# EAGLE design avr-clock (EAGLE 6.1)
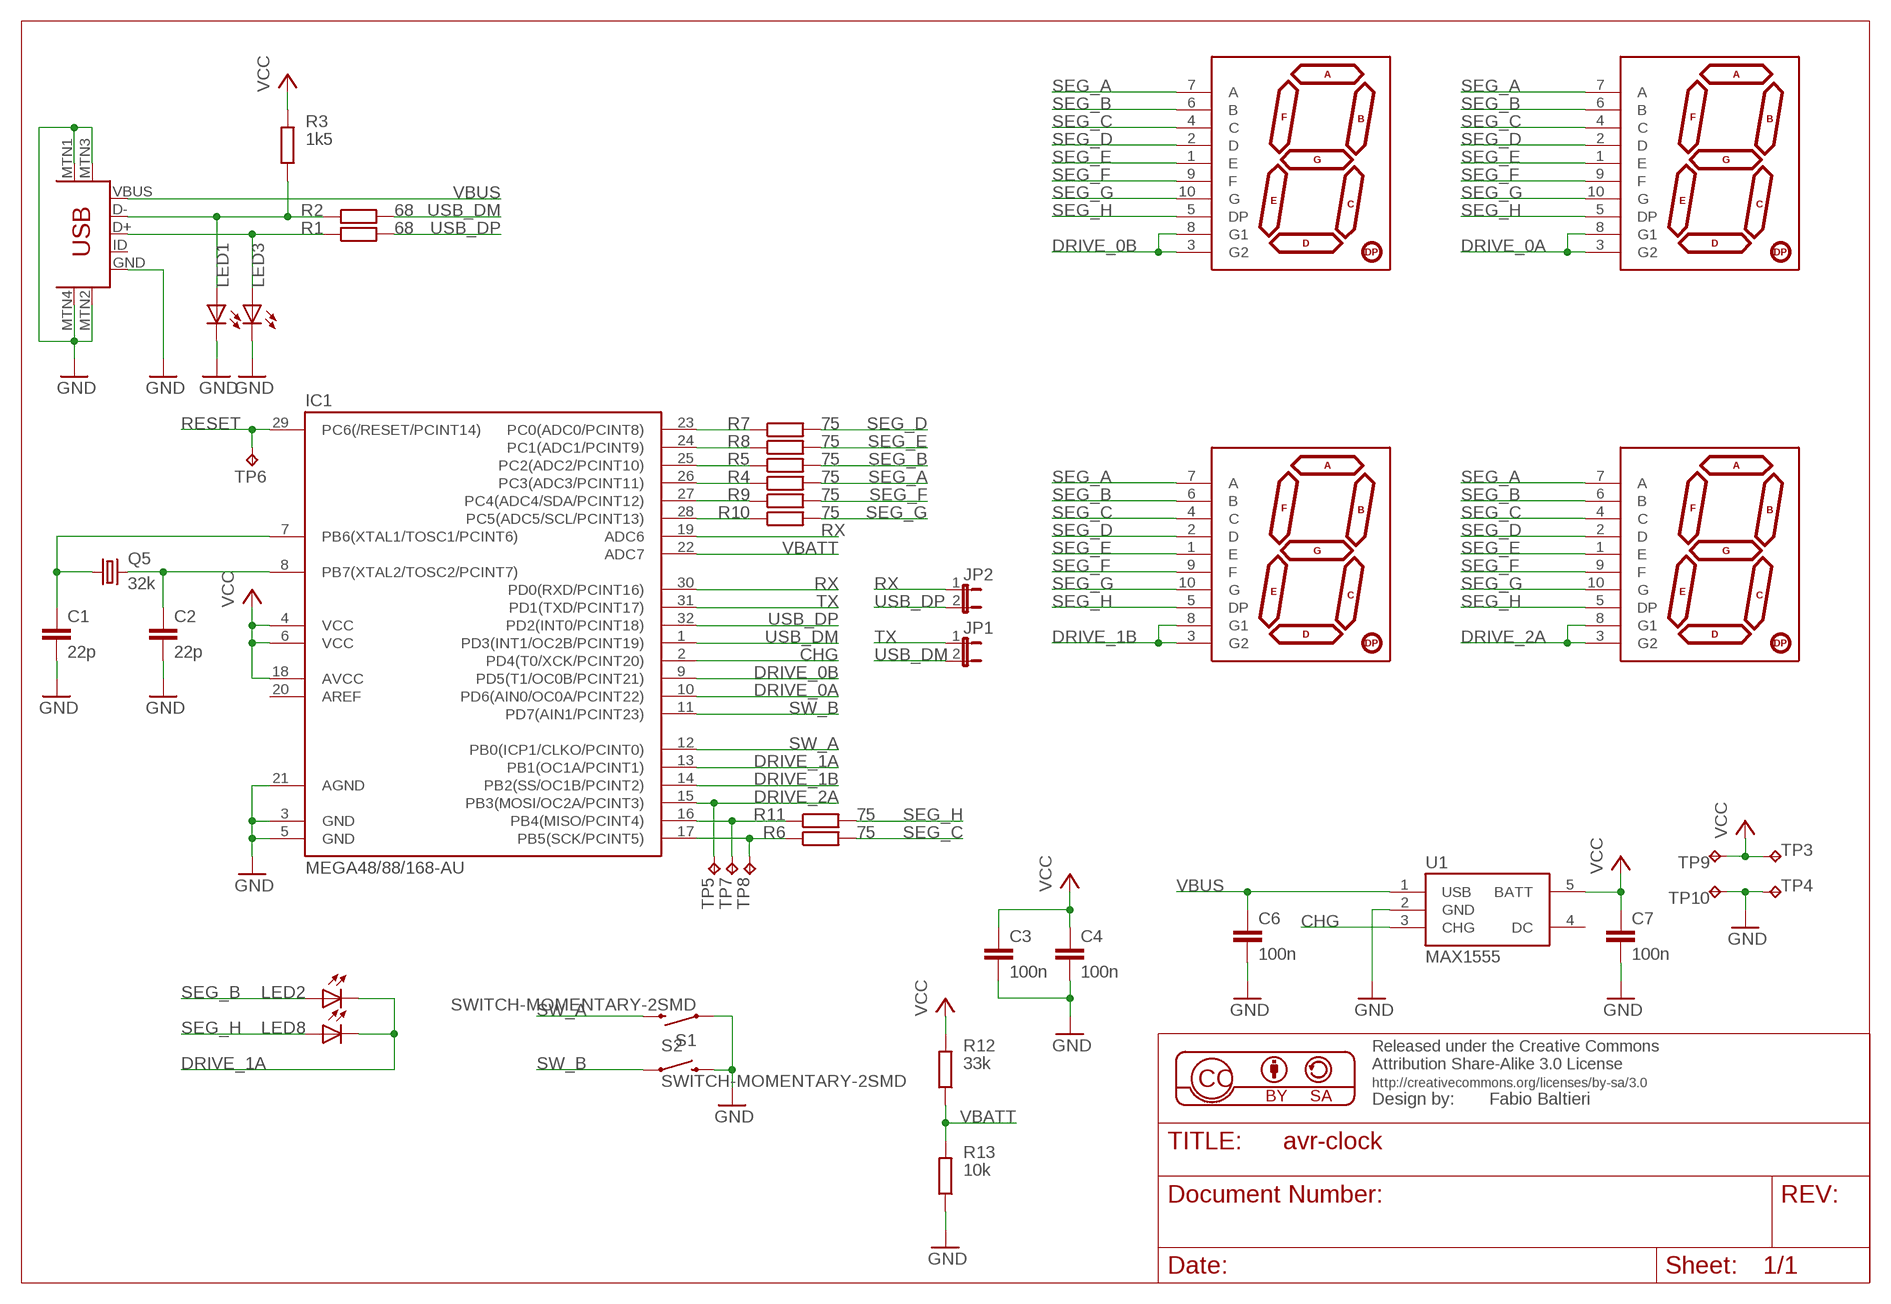
[diagram p0: schematic, sheet 1]

## Parts
C1  22p  C-EUC0805  [C0805]
C2  22p  C-EUC0805  [C0805]
C3  100n  C-EUC0805  [C0805]
C4  100n  C-EUC0805  [C0805]
C6  100n  C-EUC0805  [C0805]
C7  100n  C-EUC0805  [C0805]
IC1  MEGA48/88/168-AU  [TQFP32-08]
JP1  JUMPER-2SMD-NC  [SJ_2S]
JP2  JUMPER-2SMD-NC  [SJ_2S]
LED1  LEDCHIPLED_1206  [CHIPLED_1206]
LED2  LEDCHIPLED_1206  [CHIPLED_1206]
LED3  LEDCHIPLED_1206  [CHIPLED_1206]
LED8  LEDCHIPLED_1206  [CHIPLED_1206]
Q5  32k  CRYSTALCTS406  [CTS406]
R1  68  R-EU_R0603  [R0603]
R2  68  R-EU_R0603  [R0603]
R3  1k5  R-EU_R0603  [R0603]
R4  75  R-EU_R0603  [R0603]
R5  75  R-EU_R0603  [R0603]
R6  75  R-EU_R0603  [R0603]
R7  75  R-EU_R0603  [R0603]
R8  75  R-EU_R0603  [R0603]
R9  75  R-EU_R0603  [R0603]
R10  75  R-EU_R0603  [R0603]
R11  75  R-EU_R0603  [R0603]
R12  33k  R-EU_R0603  [R0603]
R13  10k  R-EU_R0603  [R0603]
S1  SWITCH-MOMENTARY-2SMD  [TACTILE_SWITCH_SMD]
S2  SWITCH-MOMENTARY-2SMD  [TACTILE_SWITCH_SMD]
TP3  TPB1,27  [B1,27]
TP4  TPB1,27  [B1,27]
TP5  TPTP08R  [TP08R]
TP6  TPTP08R  [TP08R]
TP7  TPTP08R  [TP08R]
TP8  TPTP08R  [TP08R]
TP9  TPTP08R  [TP08R]
TP10  TPTP08R  [TP08R]
U1  MAX1555  [SOT23-5]
U$1  7-SEGMENT-DISPLAY-1"-RED  [7-SEGMENT-SMD]
U$2  USB-MINIB-5PIN  [USB-MINIB]
U$3  7-SEGMENT-DISPLAY-1"-RED  [7-SEGMENT-SMD]
U$4  7-SEGMENT-DISPLAY-1"-RED  [7-SEGMENT-SMD]
U$5  7-SEGMENT-DISPLAY-1"-RED  [7-SEGMENT-SMD]

## Nets
CHG: IC1.2(PD4(T0/XCK/PCINT20)) U1.3(CHG)
DRIVE_0A: IC1.10(PD6(AIN0/OC0A/PCINT22)) U$3.3(G2) U$3.8(G1)
DRIVE_0B: IC1.9(PD5(T1/OC0B/PCINT21)) U$1.3(G2) U$1.8(G1)
DRIVE_1A: IC1.13(PB1(OC1A/PCINT1)) LED2.C LED8.C
DRIVE_1B: IC1.14(PB2(SS/OC1B/PCINT2)) U$4.3(G2) U$4.8(G1)
DRIVE_2A: IC1.15(PB3(MOSI/OC2A/PCINT3)) TP5.TP U$5.3(G2) U$5.8(G1)
GND: C1.2 C2.2 C3.2 C4.2 C6.2 C7.2 IC1.3(GND) IC1.5(GND) IC1.21(AGND) LED1.C LED3.C R13.1 S1.1 S2.3 TP4.TP TP10.TP U1.2(GND) U$2.GND U$2.MTN1(MTN2) U$2.MTN2(MTN3) U$2.MTN3(MTN1) U$2.MTN4
N$1: C2.1 IC1.8(PB7(XTAL2/TOSC2/PCINT7)) Q5.3
N$2: C1.1 IC1.7(PB6(XTAL1/TOSC1/PCINT6)) Q5.1
N$3: IC1.16(PB4(MISO/PCINT4)) R11.1 TP7.TP
N$4: IC1.17(PB5(SCK/PCINT5)) R6.1 TP8.TP
N$5: IC1.24(PC1(ADC1/PCINT9)) R8.1
N$6: IC1.25(PC2(ADC2/PCINT10)) R5.1
N$7: IC1.26(PC3(ADC3/PCINT11)) R4.1
N$8: IC1.27(PC4(ADC4/SDA/PCINT12)) R9.1
N$9: IC1.23(PC0(ADC0/PCINT8)) R7.1
N$12: IC1.28(PC5(ADC5/SCL/PCINT13)) R10.1
N$18: LED1.A R2.1 R3.1 U$2.D-
N$19: LED3.A R1.1 U$2.D+
RESET: IC1.29(PC6(/RESET/PCINT14)) TP6.TP
RX: IC1.19(ADC6) IC1.30(PD0(RXD/PCINT16)) JP2.1
SEG_A: R4.2 U$1.7(A) U$3.7(A) U$4.7(A) U$5.7(A)
SEG_B: LED2.A R5.2 U$1.6(B) U$3.6(B) U$4.6(B) U$5.6(B)
SEG_C: R6.2 U$1.4(C) U$3.4(C) U$4.4(C) U$5.4(C)
SEG_D: R7.2 U$1.2(D) U$3.2(D) U$4.2(D) U$5.2(D)
SEG_E: R8.2 U$1.1(E) U$3.1(E) U$4.1(E) U$5.1(E)
SEG_F: R9.2 U$1.9(F) U$3.9(F) U$4.9(F) U$5.9(F)
SEG_G: R10.2 U$1.10(G) U$3.10(G) U$4.10(G) U$5.10(G)
SEG_H: LED8.A R11.2 U$1.5(DP) U$3.5(DP) U$4.5(DP) U$5.5(DP)
SW_A: IC1.12(PB0(ICP1/CLKO/PCINT0)) S1.3
SW_B: IC1.11(PD7(AIN1/PCINT23)) S2.1
TX: IC1.31(PD1(TXD/PCINT17)) JP1.1
USB_DM: IC1.1(PD3(INT1/OC2B/PCINT19)) JP1.2 R2.2
USB_DP: IC1.32(PD2(INT0/PCINT18)) JP2.2 R1.2
VBATT: IC1.22(ADC7) R12.1 R13.2
VBUS: C6.1 U1.1(USB) U$2.VBUS
VCC: C3.1 C4.1 C7.1 IC1.4(VCC) IC1.6(VCC) IC1.18(AVCC) R3.2 R12.2 TP3.TP TP9.TP U1.5(BATT)
Unconnected: IC1.20(AREF) U1.4(DC) U$2.ID

## Library data of the parts
C1-C4 C6 C7 = rcl:C-EU: CAPACITOR, European symbol
IC1 = avr-5:MEGA48/88/168
JP1 JP2 = sparkfun:JUMPER-2: Jumper Basic 0.1" spaced jumper. Use with breakaway headers.
LED1-LED3 LED8 = led:LED: LED OSRAM: - CHIPLED LG R971, LG N971, LY N971, LG Q971, LY Q971, LO R971, LY R971 LH N974, LH R974 LS Q976, LO Q976, LY Q976 LO Q996 - Hyper CHIPLED LW Q18S LB Q993, LB Q99A, LB R99A - SideLED LS A670, LO A670, LY A670, LG A670, LP A670 LB A673, LV A673, LT A673, LW A673 LH A674 LY A675 LS A676, LA A676, LO A676, LY A676, LW A676 LS A679, LY A679, LG A679 - Hyper Micro SIDELED® LS Y876, LA Y876, LO Y876, LY Y876 LT Y87S - SmartLED LW L88C, LW L88S LB L89C, LB L89S, LG L890 LS L89K, LO L89K, LY L89K LS L896, LA L896, LO L896, LY L896 - TOPLED LS T670, LO T670, LY T670, LG T670, LP T670 LSG T670, LSP T670, LSY T670, LOP T670, LYG T670 LG T671, LOG T671, LSG T671 LB T673, LV T673, LT T673, LW T673 LH T674 LS T676, LA T676, LO T676, LY T676, LB T676, LH T676, LSB T676, LW T676 LB T67C, LV T67C, LT T67C, LS T67K, LO T67K, LY T67K, LW E67C LS E67B, LA E67B, LO E67B, LY E67B, LB E67C, LV E67C, LT E67C LW T67C LS T679, LY T679, LG T679 LS T770, LO T770, LY T770, LG T770, LP T770 LB T773, LV T773, LT T773, LW T773 LH T774 LS E675, LA E675, LY E675, LS T675 LS T776, LA T776, LO T776, LY T776, LB T776 LHGB T686 LT T68C, LB T68C - Hyper Mini TOPLED® LB M676 - Mini TOPLED Santana® LG M470 LS M47K, LO M47K, LY M47K Source: http://www.osram.convergy.de LUXEON: - LUMILED® LXK2-PW12-R00, LXK2-PW12-S00, LXK2-PW14-U00, LXK2-PW14-V00 LXK2-PM12-R00, LXK2-PM12-S00, LXK2-PM14-U00 LXK2-PE12-Q00, LXK2-PE12-R00, LXK2-PE12-S00, LXK2-PE14-T00, LXK2-PE14-U00 LXK2-PB12-K00, LXK2-PB12-L00, LXK2-PB12-M00, LXK2-PB14-N00, LXK2-PB14-P00, LXK2-PB14-Q00 LXK2-PR12-L00, LXK2-PR12-M00, LXK2-PR14-Q00, LXK2-PR14-R00 LXK2-PD12-Q00, LXK2-PD12-R00, LXK2-PD12-S00 LXK2-PH12-R00, LXK2-PH12-S00 LXK2-PL12-P00, LXK2-PL12-Q00, LXK2-PL12-R00 Source: www.luxeon.com KINGBRIGHT: KA-3528ASYC Source: www.kingbright.com
Q5 = crystal:CRYSTAL: CRYSTAL
R1-R13 = rcl:R-EU_: RESISTOR, European symbol
S1 S2 = sparkfun:SWITCH-MOMENTARY-2
TP3-TP10 = testpad:TP: Test pad
U1 = sparkfun:MAX1555: MAX1555 Lithium Charger IC SOT-23 Lithium Polymer charging IC. Schematic element and footprint proven. Spark Fun Electronics SKU : COM-00674
U$1 U$3-U$5 = balto:7-SEGMENT-DISPLAY-1"-RED: 7-Segment Display 1" Red (COM-08546)
U$2 = sparkfun:USB-MINIB: Mini-USB "B" connector with 5th pin broken out. Created new symbol breaking out 5th "ID" pin in mini/micro USB connector spec. See: http://en.wikipedia.org/wiki/Mini_usb#Cables. Uses same footprint as 4-pin symbol. Also added pins to connect to mounting / shield pads if required (probably not generally needed as signals aren't shielded once they leave the connector).

## Board
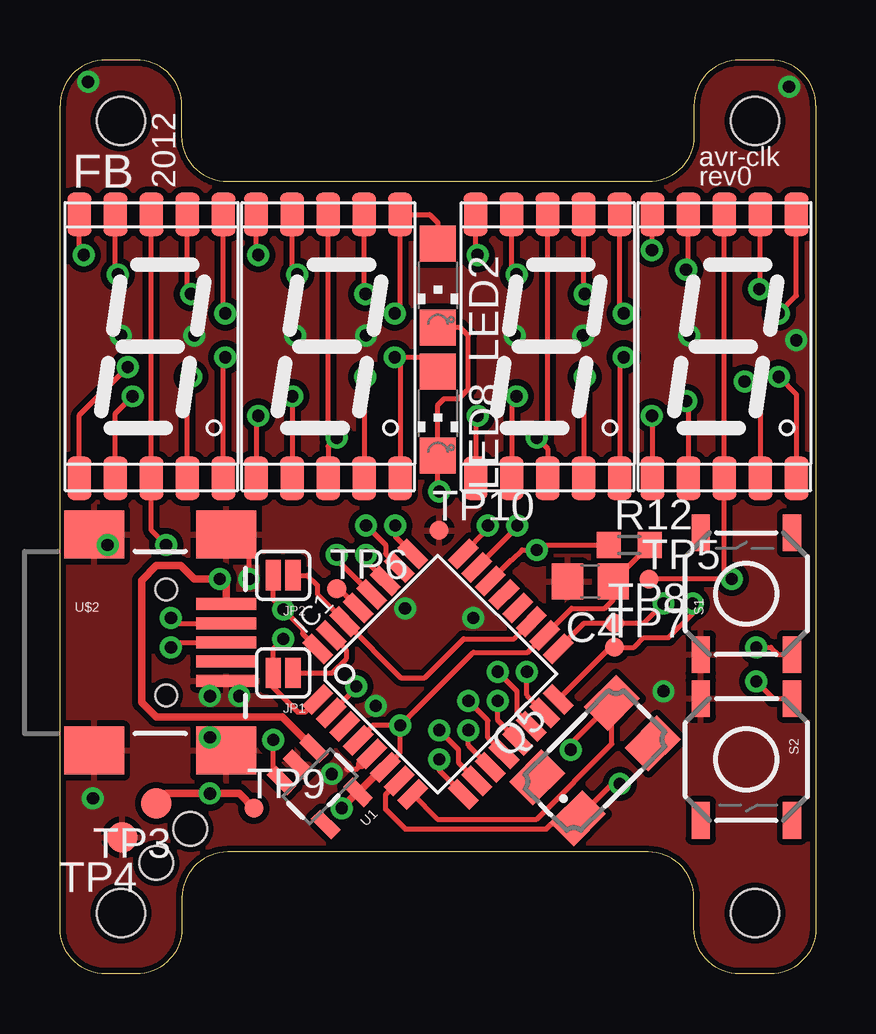
[diagram p1: board, top side]
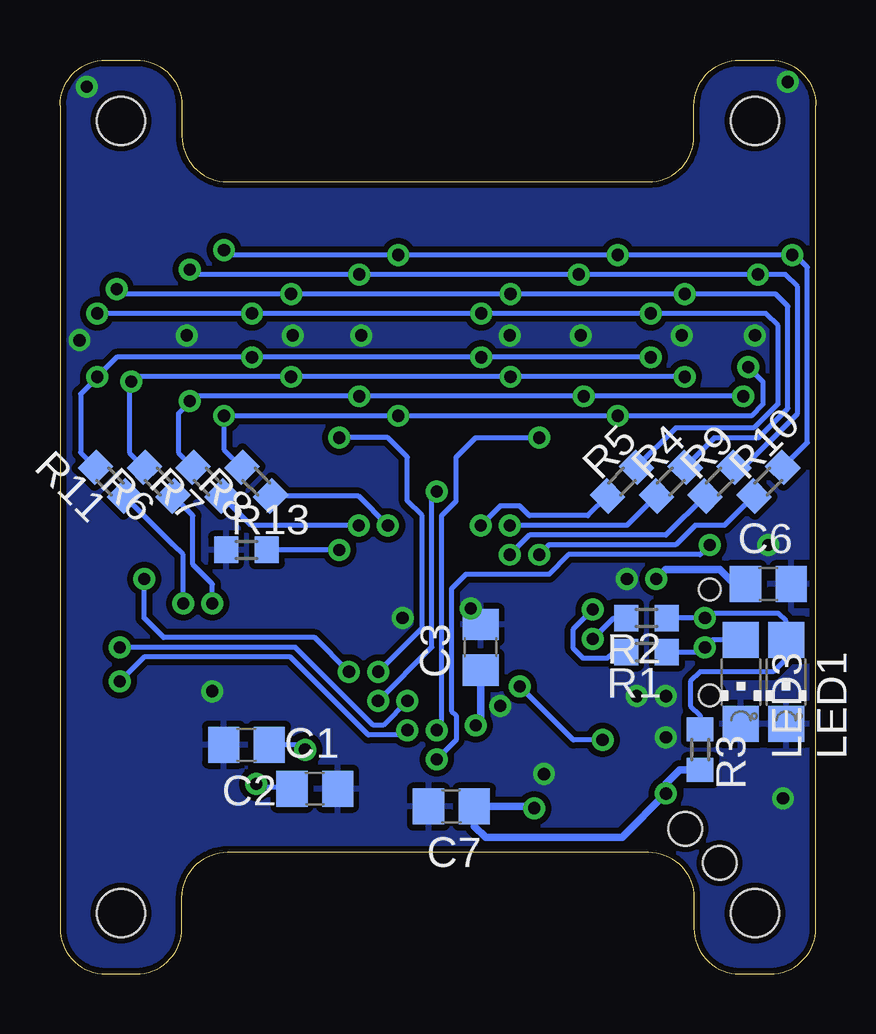
[diagram p2: board, bottom side, seen from below]

Size 31.5 x 38.1 mm. Coordinates in mm from the lower left corner, seen from the top.
Outline: 31.5,36.2 arc90 29.59,38.1 28.32,38.1 arc90 26.42,36.2 26.42,34.93 arc-90 24.51,33.02 6.98,33.02 arc-90 5.08,34.93 5.08,36.2 arc90 3.17,38.1 1.9,38.1 arc90 0,36.2 0,1.9 arc90 1.9,0 3.17,0 arc90 5.08,1.9 5.08,3.17 arc-90 6.98,5.08 24.51,5.08 arc-90 26.42,3.17 26.42,1.9 arc90 28.32,0 29.59,0 arc90 31.5,1.9 31.5,36.2
Copper layers (1*16): Top 0.035mm / dielectric 1.5mm / Bottom 0.035mm
Design rules "default *": minimum track width 8mil, minimum drill 20mil, track to track 8mil, track to pad 8mil, pad to pad 8mil, via to via 8mil, smd to smd 8mil, copper to edge 8mil, drill to drill 8mil, minimum pad ring 10mil, minimum via ring 8mil, stop-mask expansion 4mil, vias tented up to drill 20mil, thermal gap 10mil
Holes 1.4 mm at 5.44,6.05 4.01,4.62
Holes 2 mm at 2.54,2.54 28.96,2.54 28.96,35.56 2.54,35.56

### Footprints (pad centres in the part's own frame; a part is rotated, then mirrored left to right if it is on the bottom)
C0805 = smd 1.3 x 1.5: 1 -0.95,0; 2 0.95,0
TQFP32-08 = smd 1.27 x 0.559: 1 -4.293,2.8; 2 -4.293,2; 3 -4.293,1.2; 4 -4.293,0.4; 5 -4.293,-0.4; 6 -4.293,-1.2; 7 -4.293,-2; 8 -4.293,-2.8; 17 4.293,-2.8; 18 4.293,-2; 19 4.293,-1.2; 20 4.293,-0.4; 21 4.293,0.4; 22 4.293,1.2; 23 4.293,2; 24 4.293,2.8 | smd 0.559 x 1.27: 9 -2.8,-4.293; 10 -2,-4.293; 11 -1.2,-4.293; 12 -0.4,-4.293; 13 0.4,-4.293; 14 1.2,-4.293; 15 2,-4.293; 16 2.8,-4.293; 25 2.8,4.293; 26 2,4.293; 27 1.2,4.293; 28 0.4,4.293; 29 -0.4,4.293; 30 -1.2,4.293; 31 -2,4.293; 32 -2.8,4.293
SJ_2S = smd 0.635 x 1.27: 1 -0.412,0; 2 0.412,0
CHIPLED_1206 = smd 1.5 x 1.5: A 0,-1.75; C 0,1.75
CTS406 = smd 1.9 x 1.4: 1 -2.2,-1.2; 2 2.2,-1.2; 3 2.2,1.2; 4 -2.2,1.2
R0603 = smd 1 x 1.1: 1 -0.85,0; 2 0.85,0
TACTILE_SWITCH_SMD = smd 1.524 x 0.762: 1 -2.54,1.905; 2 2.54,1.905; 3 -2.54,-1.905; 4 2.54,-1.905
B1,27 = smd 1.27 x 1.27: TP 0,0
TP08R = smd 0.8 x 0.8: TP 0,0
SOT23-5 = smd 0.55 x 1.2: 1 -0.95,-1.3; 2 0,-1.3; 3 0.95,-1.3; 4 0.95,1.3; 5 -0.95,1.3
7-SEGMENT-SMD = smd 1 x 1.8: 1 -3,-5.5; 2 -1.5,-5.5; 3 0,-5.5; 4 1.5,-5.5; 5 3,-5.5; 6 3,5.5; 7 1.5,5.5; 8 0,5.5; 9 -1.5,5.5; 10 -3,5.5
USB-MINIB = smd 2.5 x 0.5: D+ 2.5,0; D- 2.5,0.8; GND 2.5,-1.6; ID 2.5,-0.8; VBUS 2.5,1.6 | smd 2.5 x 2: MTN1 -3,4.5; MTN2 2.5,4.5; MTN3 -3,-4.5; MTN4 2.5,-4.5 | hole 0.9: 0,2.2; 0,-2.2

### Placement (x,y rotation side)
C1  20.88,7.72 0 bottom
C2  23.72,9.55 180 bottom
C3  13.97,13.61 90 bottom
C4  22.1,16.36 180 top
C6  1.98,16.26 0 bottom
C7  15.19,6.98 180 bottom
IC1  15.75,12.5 45 top
JP1  9.3,12.55 180 top
JP2  9.3,16.61 180 top
LED1  1.24,12.17 180 bottom
LED2  15.75,28.7 180 top
LED3  3.12,12.17 180 bottom
LED8  15.75,23.37 180 top
Q5  22.29,8.9 45 top
R1  7.06,13.41 180 bottom
R2  7.06,14.83 180 bottom
R3  4.83,9.35 270 bottom
R4  330  [R0603]  6.05,20.52 45 bottom
R5  330  [R0603]  8.08,20.52 45 bottom
R6  330  [R0603]  27.38,20.52 135 bottom
R7  330  [R0603]  25.35,20.52 135 bottom
R8  330  [R0603]  23.32,20.52 135 bottom
R9  330  [R0603]  4.01,20.52 45 bottom
R10  330  [R0603]  1.98,20.52 45 bottom
R11  330  [R0603]  29.41,20.52 135 bottom
R12  10k  [R0603]  23.72,17.88 0 top
R13  23.72,17.68 0 bottom
S1  28.6,15.85 90 top
S2  28.6,8.94 270 top
TP3  4.01,7.11 180 top
TP4  2.59,5.69 180 top
TP5  24.54,16.46 0 top
TP6  11.53,16.05 0 top
TP7  23.11,13.61 0 top
TP8  23.11,14.63 0 top
TP9  8.08,6.91 0 top
TP10  15.8,18.49 0 top
U1  10.83,7.82 225 top
U$1  3.81,26.16 0 top
U$2  4.42,13.82 0 top
U$3  11.18,26.16 0 top
U$4  20.32,26.16 0 top
U$5  27.69,26.16 0 top

### Tracks (layer width: path | path; a pad name or v marks a point on that pad's centre or on a via)
CHG  (via drill 0.51)
  Top 0.203: U1.3 8.89,8.41 v8.89,9.75 | IC1.2 12.34,11.92 v12.34,11.99
  Bottom 0.203: v8.89,9.75 10.11,9.75 v12.34,11.99
DRIVE_0A  (via drill 0.51)
  Top 0.203: U$3.3 11.18,22 v11.53,22.35 11.18,22.71 U$3.8 | IC1.10 16.61,8.8 16.61,9.35 v15.8,10.16
  Bottom 0.203: v11.53,22.35 14.17,22.35 14.99,21.54 14.99,19.71 15.6,19.1 15.6,10.36 v15.8,10.16
DRIVE_0B  (via drill 0.51)
  Top 0.203: U$1.8 U$1.3 3.81,18.49 v4.42,17.88 4.22,18.08 | IC1.9 15.8,8.49 v15.8,8.94
  Bottom 0.203: v4.42,17.88 4.83,17.47 10.31,17.47 11.12,16.66 14.58,16.66 15.19,16.05 15.19,10.97 14.99,10.77 14.99,9.75 v15.8,8.94
DRIVE_1A  (via drill 0.51)
  Top 0.203: LED2.C 16.68,26.95 17.02,26.62 17.02,24.38 16.61,23.98 16,23.98 15.75,23.72 LED8.C 15.75,20.17 v15.8,20.12 | IC1.13 18.24,10.57 v18.24,11.38
  Bottom 0.203: v15.8,20.12 16,19.91 16,13.62 v18.24,11.38
DRIVE_1B  (via drill 0.51)
  Top 0.203: U$4.3 20.32,21.89 v19.86,22.35 20.32,22.81 U$4.8 | IC1.14 19.05,10.89 19.05,11.79 v18.24,12.6
  Bottom 0.203: v19.86,22.35 17.83,22.35 17.02,21.54 17.02,19.71 16.41,19.1 16.41,14.43 v18.24,12.6
DRIVE_2A  (via drill 0.51)
  Top 0.203: U$5.8 U$5.3 27.69,16.76 v27.99,16.46 TP5.TP | IC1.15 19.46,11.62 v19.46,12.6
  Bottom 0.203: v19.46,12.6 20.88,14.02 27.18,14.02 27.99,14.83 v27.99,16.46
GND  (via drill 0.51)
  Top 0.203: 12.55,8.74 12.34,8.53 11.94,8.53 | U$2.MTN2 7.87,17.36 v7.87,16.46
  Top 0.406: IC1.5 12.55,8.74
  other vias: 2.54,26.62 30.68,26.42 26.21,26.62 21.79,26.62 18.95,26.62 12.75,26.62 9.8,26.62 5.59,26.62 11.33,8.33 17.22,14.83 13.16,11.18 25.15,11.79 1.37,7.32 1.98,17.88 1.17,37.19 30.38,36.98 6.25,11.58 7.47,11.58 6.25,9.86 14.38,15.24
  pour Bottom (isolate 0.254): 0,-0.03 31.5,-0.03 31.5,38.1 0,38.1
  pour Top (isolate 0.254): 0,-0.03 31.5,-0.03 31.5,38.1 0,38.1
N$1  (via drill 0.51)
  Top 0.203: IC1.8 15.72,6.45 19.86,6.45 23,9.59 Q5.3 21.29,9.59 v21.29,9.35
  Bottom 0.203: C2.1 21.49,9.55 v21.29,9.35
N$2  (via drill 0.51)
  Top 0.203: IC1.7 13.56,7.48 13.56,6.86 14.38,6.04 20.27,6.04 20.47,6.25 21.34,6.25 Q5.1 23.01,7.93 v23.32,7.93
  Bottom 0.203: C1.1 21.89,7.79 23.18,7.79 v23.32,7.93
N$3  (via drill 0.51)
  Top 0.203: 21.08,11.76 IC1.16 22.94,13.61 TP7.TP 23.93,13.61 24.33,14.02 25.35,14.02 26.36,15.04 v26.36,15.44
  Bottom 0.203: R11.1 27.58,18.69 26.77,17.88 26.36,17.47 v26.36,15.44
N$4  (via drill 0.51)
  Top 0.203: IC1.17 21.84,14.63 TP8.TP 24.33,14.63 v25.15,15.44
  Bottom 0.203: v25.15,15.44 25.15,16.26 25.96,17.07 25.96,19.1 R6.1
N$5  (via drill 0.51)
  Top 0.203: IC1.24 17.83,18.54 v17.83,18.69
  Bottom 0.203: R8.1 19.06,19.92 v17.83,18.69
N$6  (via drill 0.51)
  Top 0.203: IC1.25 13.97,18.23 v13.97,18.69
  Bottom 0.203: R5.1 9.5,19.1 11.94,19.1 12.34,19.51 13.16,19.51 v13.97,18.69
N$7  (via drill 0.51)
  Top 0.203: IC1.26 13.56,17.51 13.56,17.88 v12.75,18.69
  Bottom 0.203: v12.75,18.69 7.87,18.69 R4.1
N$8  (via drill 0.51)
  Top 0.203: IC1.27 12.75,17.19 v12.75,17.47
  Bottom 0.203: v12.75,17.47 11.94,18.29 6.25,18.29 R9.1
N$9  (via drill 0.51)
  Top 0.203: IC1.23 19.05,18.63 v19.05,18.69
  Bottom 0.203: R7.1 23.52,18.69 v19.05,18.69
N$12  (via drill 0.51)
  Top 0.203: IC1.28 11.53,17.28 v11.53,17.47
  Bottom 0.203: v11.53,17.47 11.12,17.88 5.84,17.88 5.03,18.69 3.81,18.69 R10.1
N$18  (via drill 0.51)
  Top 0.203: U$2.D- 4.84,14.62 v4.62,14.83
  Bottom 0.203: R3.1 4.83,10.77 5.23,11.18 5.23,12.19 4.83,12.6 1.78,12.6 1.25,13.13 LED1.A 1.25,14.71 1.57,15.04 4.42,15.04 v4.62,14.83 R2.1
N$19  (via drill 0.51)
  Top 0.203: v4.62,13.61 4.83,13.82 U$2.D+
  Bottom 0.203: LED3.A 4.32,13.92 v4.62,13.61 4.83,13.41 R1.1
RESET
  Top 0.203: IC1.29 11.63,16.05 TP6.TP
RX
  Top 0.203: JP2.1 10.31,16.61 10.72,16.2 10.72,15.83 IC1.30 14.2,12.34 15.19,12.34 16.81,13.97 18.92,13.97 IC1.19
SEG_A  (via drill 0.51)
  Top 0.203: U$1.7 5.31,28.5 v5.46,28.35 | v29.13,28.55 29.19,28.6 U$5.7 | U$3.7 12.68,28.4 v12.72,28.35 | U$4.7 21.82,28.4 v21.87,28.35
  Bottom 0.203: v29.13,28.55 28.93,28.35 v21.87,28.35 v12.72,28.35 v5.46,28.35 1.68,28.35 1.17,27.84 1.17,23.57 2.39,22.35 4.22,22.35 R4.2
SEG_B  (via drill 0.51)
  Top 0.203: U$1.6 6.81,27.61 v6.88,27.53 | U$4.6 23.32,27.71 v23.49,27.53 | LED2.A 15.75,31.32 15.4,31.66 U$3.6 14.18,27.76 v13.95,27.53 | U$5.6 30.69,28.27 v29.95,27.53
  Bottom 0.203: v29.95,27.53 v23.49,27.53 v13.95,27.53 v6.88,27.53 2.08,27.53 1.57,27.03 1.57,23.77 2.59,22.76 5.84,22.76 R5.2
SEG_C  (via drill 0.51)
  Top 0.203: U$1.4 5.31,24.74 v5.46,24.89 | U$3.4 12.68,24.84 v12.72,24.89 | U$4.4 21.82,24.84 v21.87,24.89 | U$5.4 29.19,24.03 v28.52,24.69
  Bottom 0.203: v5.46,24.89 v12.72,24.89 v21.87,24.89 28.32,24.89 v28.52,24.69 28.52,24.66 28.6,24.59 28.6,21.74 R6.2
SEG_D  (via drill 0.51)
  Top 0.203: U$1.2 2.31,23.37 v3.02,24.08 | v26.09,23.88 26.19,23.78 U$5.2 | v9.68,24.08 U$3.2 9.68,20.29 | U$4.2 18.82,23.88 v19.02,24.08
  Bottom 0.203: v3.02,24.08 v9.68,24.08 v19.02,24.08 25.88,24.08 v26.09,23.88 26.09,23.85 26.57,23.37 26.57,21.74 R7.2
SEG_E  (via drill 0.51)
  Top 0.203: v24.66,23.27 24.69,23.24 U$5.1 | U$3.1 8.18,23.19 v8.26,23.27 | U$4.1 17.32,23.19 v17.4,23.27 | U$1.1 0.81,23.29 v2.82,25.3
  Bottom 0.203: v8.26,23.27 2.69,23.27 2.21,23.75 2.21,24.69 v2.82,25.3 | v8.26,23.27 v17.4,23.27 v24.66,23.27 24.66,21.87 R8.2 | v8.26,23.27 8.24,23.25
SEG_F  (via drill 0.51)
  Top 0.203: U$1.9 2.31,29.26 v2.41,29.16 | v26.09,29.36 26.19,29.46 U$5.9 | U$3.9 9.68,29.36 v9.88,29.16 | U$4.9 18.82,29.36 v19.02,29.16
  Bottom 0.203: v26.09,29.36 25.88,29.16 v19.02,29.16 v9.88,29.16 v2.41,29.16 1.27,29.16 0.76,28.65 0.76,23.37 3.01,21.12 R9.2
SEG_G  (via drill 0.51)
  Top 0.203: U$1.10 0.81,30.15 v0.99,29.97 | U$5.10 24.69,30.2 v24.66,30.17 | U$3.10 8.18,30.05 v8.26,29.97 | U$4.10 17.32,30.05 v17.4,29.97
  Bottom 0.203: v24.66,30.17 24.46,29.97 v17.4,29.97 v8.26,29.97 v0.99,29.97 0.86,29.97 0.36,29.46 0.36,22.15 R10.2
SEG_H  (via drill 0.51)
  Top 0.203: U$1.5 6.81,25.63 v6.88,25.7 | U$4.5 23.32,25.53 v23.49,25.7 | U$3.5 14.18,25.47 v13.95,25.7 15.16,25.7 LED8.A | U$5.5 30.69,24.15 v29.95,24.89
  Bottom 0.203: v6.88,25.7 v13.95,25.7 v23.49,25.7 29.13,25.7 v29.95,24.89 29.95,24.87 30.63,24.18 30.63,21.74 R11.2
SW_A  (via drill 0.51)
  Top 0.203: IC1.12 17.83,9.85 17.83,10.57 v17.02,11.38 | 29.41,13.61 v29.01,13.61 29.62,13.61 29.92,13.31 S1.3
  Bottom 0.203: v17.02,11.38 18.03,10.36 18.44,10.36 21.69,13.61 v29.01,13.61
SW_B  (via drill 0.51)
  Top 0.203: IC1.11 17.02,9.53 v17.02,10.16 | 29.21,11.99 v29.01,12.19 29.72,11.48 S2.1
  Bottom 0.203: v17.02,10.16 17.22,9.96 18.64,9.96 21.89,13.21 27.99,13.21 v29.01,12.19
TX
  Top 0.203: JP1.1 11.33,12.55 11.94,13.16 11.94,13.48 IC1.31
USB_DM  (via drill 0.51)
  Top 0.203: v9.3,13.97 8.88,13.56 JP1.2 8.88,11.94 9.91,10.92 10.21,10.92 IC1.1
  Bottom 0.203: R2.2 8.43,14.83 v9.3,13.97
USB_DP  (via drill 0.51)
  Top 0.203: JP2.2 8.88,15.6 v9.3,15.19 10.11,14.38 10.11,14.18 IC1.32
  Bottom 0.203: v9.3,15.19 10.11,14.38 10.11,13.56 9.7,13.16 8.69,13.16 8.43,13.41 R1.2
VBATT  (via drill 0.51)
  Top 0.203: IC1.22 18.83,17.27 18.85,17.27 19.25,17.68 v19.86,17.68 20.07,17.88 R12.1
  Bottom 0.203: v19.86,17.68 R13.2
VBUS  (via drill 0.51)
  Top 0.305: U$2.VBUS 6.92,16.19 v6.65,16.46 5.59,16.46 5.03,17.02 4.01,17.02 3.4,16.41 3.4,11.33 4.01,10.72 9.27,10.72 U1.1
  Bottom 0.305: v6.65,16.46 6.25,16.87 4.01,16.87 3.4,16.26 C6.1
VCC  (via drill 0.51)
  Top 0.203: 24.67,18.22 R12.2 23.29,16.6 23.05,16.6 C4.1 23.05,15.58 22.71,15.24 21.32,15.24 IC1.18 19.49,13.41 17.22,13.41 v14.17,10.36 | IC1.4 13.05,10.36 v14.17,10.36 | IC1.6 14.17,9.22 v14.17,10.36
  Top 0.305: IC1.6 13.46,8.61 U1.5 12.39,7.57 v11.74,6.91 | TP9.TP 7.47,7.52 v6.25,7.52 4.42,7.52 TP3.TP
  Bottom 0.305: C3.1 13.97,10.57 v14.17,10.36 | v11.74,6.91 11.81,6.98 C7.1 14.24,6.16 13.77,5.69 8.08,5.69 v6.25,7.52 6.25,7.93 5.68,8.5 R3.2

### Text on the board
_tsilk: avr-clk | FB | 2012 | rev0